# Altium schematic sheet sheet4_sk6812.SchDoc: Proximo: SK6812
size A4; Organization: Ideetron B.V.; Address1: Dorpstraat 81; Address2: 3941 JL Doorn; Address3: 3941 JL Doorn; Address4: The Netherlands; SheetNumber: 4
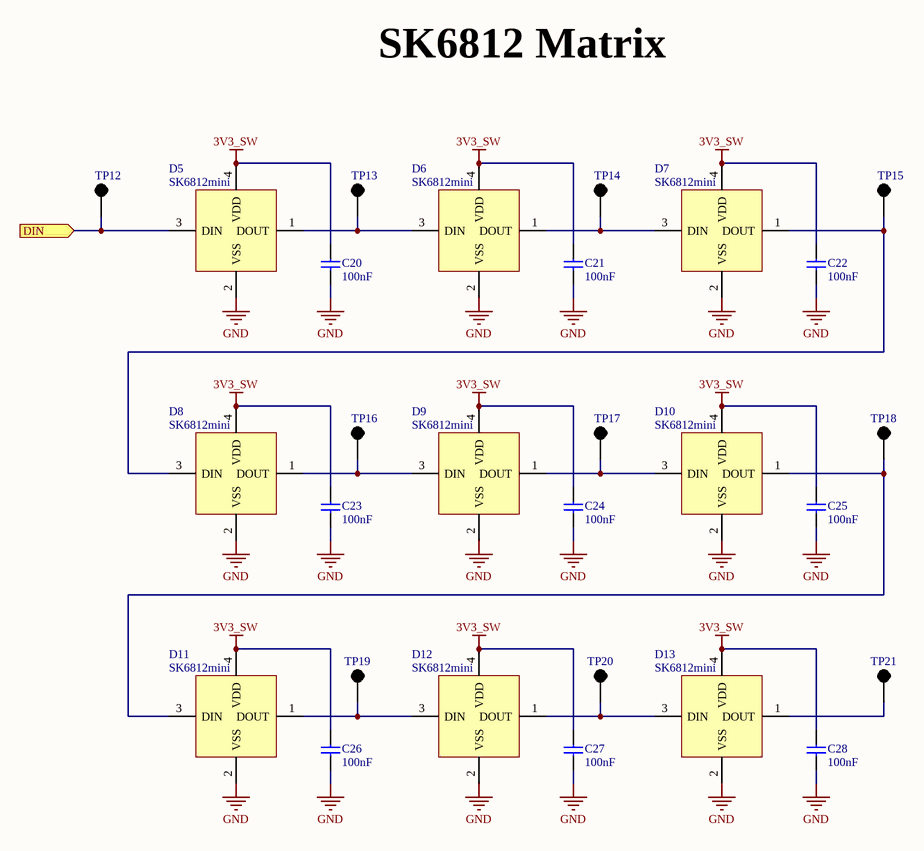
[diagram p0: sheet4_sk6812.SchDoc]

## Parts
C20  100nF  [CAP0603_GCx18_MURATA]
C21  100nF  [CAP0603_GCx18_MURATA]
C22  100nF  [CAP0603_GCx18_MURATA]
C23  100nF  [CAP0603_GCx18_MURATA]
C24  100nF  [CAP0603_GCx18_MURATA]
C25  100nF  [CAP0603_GCx18_MURATA]
C26  100nF  [CAP0603_GCx18_MURATA]
C27  100nF  [CAP0603_GCx18_MURATA]
C28  100nF  [CAP0603_GCx18_MURATA]
D5  SK6812mini  [SK6812mini]
D6  SK6812mini  [SK6812mini]
D7  SK6812mini  [SK6812mini]
D8  SK6812mini  [SK6812mini]
D9  SK6812mini  [SK6812mini]
D10  SK6812mini  [SK6812mini]
D11  SK6812mini  [SK6812mini]
D12  SK6812mini  [SK6812mini]
D13  SK6812mini  [SK6812mini]
TP12  testpad  [TestPad]  (value not drawn)  (no BOM)
TP13  testpad  [TestPad]  (value not drawn)  (no BOM)
TP14  testpad  [TestPad]  (value not drawn)  (no BOM)
TP15  testpad  [TestPad]  (value not drawn)  (no BOM)
TP16  testpad  [TestPad]  (value not drawn)  (no BOM)
TP17  testpad  [TestPad]  (value not drawn)  (no BOM)
TP18  testpad  [TestPad]  (value not drawn)  (no BOM)
TP19  testpad  [TestPad]  (value not drawn)  (no BOM)
TP20  testpad  [TestPad]  (value not drawn)  (no BOM)
TP21  testpad  [TestPad]  (value not drawn)  (no BOM)

## Ports
DIN (in)

## Nets
3V3_SW: C20.2 C21.2 C22.2 C23.2 C24.2 C25.2 C26.2 C27.2 C28.2 D5.4(VDD) D6.4(VDD) D7.4(VDD) D8.4(VDD) D9.4(VDD) D10.4(VDD) D11.4(VDD) D12.4(VDD) D13.4(VDD)
GND: C20.1 C21.1 C22.1 C23.1 C24.1 C25.1 C26.1 C27.1 C28.1 D5.2(VSS) D6.2(VSS) D7.2(VSS) D8.2(VSS) D9.2(VSS) D10.2(VSS) D11.2(VSS) D12.2(VSS) D13.2(VSS)
DIN: D5.3(DIN) TP12.1 ; port DIN
NetD5_1: D5.1(DOUT) D6.3(DIN) TP13.1
NetD6_1: D6.1(DOUT) D7.3(DIN) TP14.1
NetD7_1: D7.1(DOUT) D8.3(DIN) TP15.1
NetD8_1: D8.1(DOUT) D9.3(DIN) TP16.1
NetD9_1: D9.1(DOUT) D10.3(DIN) TP17.1
NetD10_1: D10.1(DOUT) D11.3(DIN) TP18.1
NetD11_1: D11.1(DOUT) D12.3(DIN) TP19.1
NetD12_1: D12.1(DOUT) D13.3(DIN) TP20.1
NetD13_1: D13.1(DOUT) TP21.1

## Notes on the sheet
- SK6812 Matrix
- Title
- Size:
- A4
- Number:
- Revision:
- Date:
- Time:
- Sheet
- of

## Library data of the parts
C20-C28 = CAP_0603_100nF: Capacitor 0603 100nF; Manufacturer: Murata; Manufacturer Part Number: GCJ188R71C104KA01D; Sponsor: Nijkerk Electronics; Pin Count: 2; Value: 100nF
D5-D13 = SK6812: RGB LED with integrated controller; Manufacturer: Dongguang opsco optoelectronics CO. LTD; Sponsor: WoTS via Ideetron; value: SK6812mini; Manufacturer Part Number: *
TP12-TP21 = TestPad: Signal probe pad; value: testpad